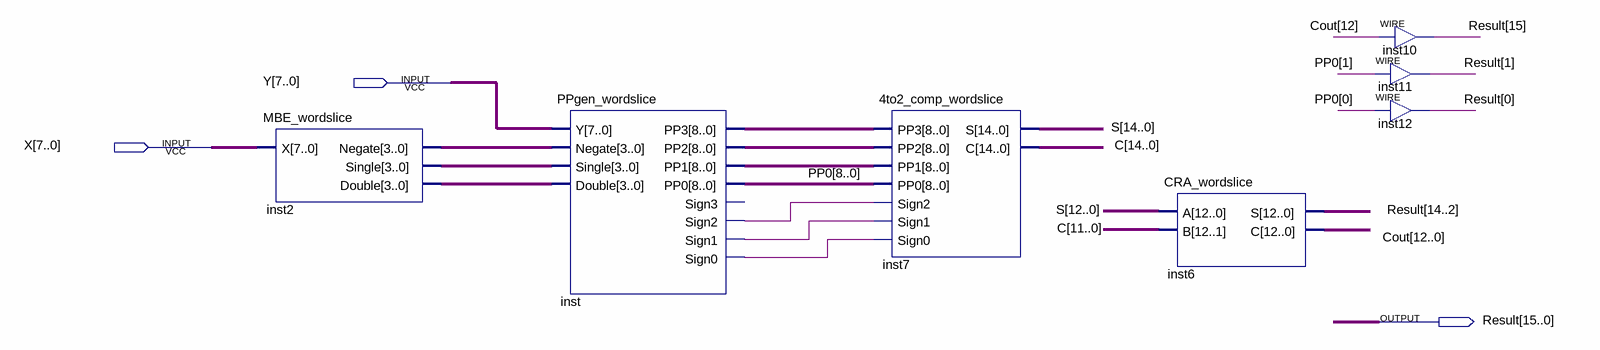
[diagram p0: schematic sheet]
// Quartus schematic top_level.bdf as structural Verilog: 7 symbols, 3 pins
module top_level (
  input  [7:0] Y,
  input  [7:0] X,
  output [15:0] Result
);

  wire inst_sign0, inst_sign1, inst_sign2;
  wire [3:0] inst2_double, inst2_negate, inst2_single;
  wire [8:0] inst_pp1, inst_pp2, inst_pp3, PP0;
  wire [12:0] Cout;
  wire [14:0] C, S;

  MBE_wordslice inst2 (.X(X), .Negate(inst2_negate), .Single(inst2_single), .Double(inst2_double));
  PPgen_wordslice inst (
    .Y(Y), .Negate(inst2_negate), .Single(inst2_single), .Double(inst2_double), .PP3(inst_pp3),
    .PP2(inst_pp2), .PP1(inst_pp1), .PP0(PP0), .Sign2(inst_sign2), .Sign1(inst_sign1), .Sign0(inst_sign0));  // open: Sign3
  \4to2_comp_wordslice  inst7 (
    .PP3(inst_pp3), .PP2(inst_pp2), .PP1(inst_pp1), .PP0(PP0), .Sign2(inst_sign2), .Sign1(inst_sign1),
    .Sign0(inst_sign0), .S(S), .C(C));
  CRA_wordslice inst6 (.A(S[12:0]), .B(C[11:0]), .S(Result[14:2]), .C(Cout));
  assign Result[15] = Cout[12];  // WIRE inst10
  assign Result[1] = PP0[1];  // WIRE inst11
  assign Result[0] = PP0[0];  // WIRE inst12
endmodule
